# Altium schematic sheet Fri3D_IRA_Power.SchDoc: Power
size A3; Date: 25/07/2021; DrawnBy: Wim Van Gool; DocumentNumber: 4; Revision: 00; SheetNumber: 4; SheetTotal: 4
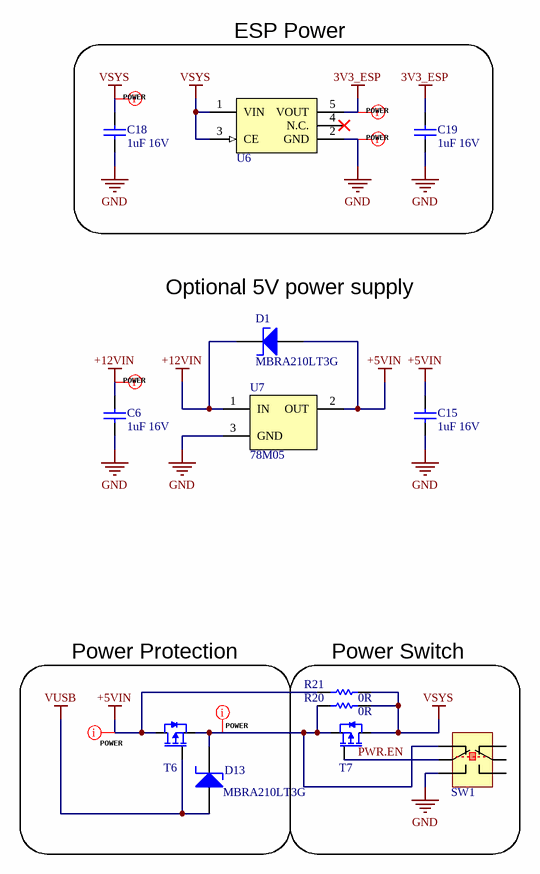
[diagram p0: Fri3D_IRA_Power.SchDoc]

## Parts
C6  value 1uF 16V  [C0603_N]  (hidden comment: CAP_CERAMIC)
C15  value 1uF 16V  [C0603_N]  (hidden comment: CAP_CERAMIC)
C18  value 1uF 16V  [C0603_N]  (hidden comment: CAP_CERAMIC)
C19  value 1uF 16V  [C0603_N]  (hidden comment: CAP_CERAMIC)
D1  MBRA210LT3G  [SMA_AC]
D13  MBRA210LT3G  [SMA_AC]
R20  value 0R  [R0603_N]  (hidden comment: RESISTOR)
R21  value 0R  [R0603_N]  (hidden comment: RESISTOR)
SW1  Mini slide switch 2P2T  [MSS22D18]  (value not drawn)
T6  -2.3A -20V P-Ch MOSFET Vgs -1V  [SOT23-3]  (value not drawn)
T7  -2.3A -20V P-Ch MOSFET Vgs -1V  [SOT23-3]  (value not drawn)
U6  3V3 LDO 700mA 50mV  [SOT23-5]  (value not drawn)
U7  78M05  [TO-252]

## Blocks framed on the sheet
ESP Power: C18 C19 U6
Power Protection: D13 T6
Power Switch: R20 R21 SW1 T7

## Nets
3V3_ESP: C19.1 U6.5(VOUT)
+5VIN: C15.1 D1.A R21.2 T6.3(D) U7.2(OUT)
+12VIN: C6.1 D1.C U7.1(IN)
GND: C6.2 C15.2 C18.2 C19.2 SW1.5 U6.2(GND) U7.3(GND)
VSYS: C18.1 R20.1 R21.1 T7.3(D) U6.1(VIN) U6.3(CE)
VUSB: D13.A T6.1(G)
PWR.EN: SW1.3 T7.1(G)
NetD13_C: D13.C R20.2 SW1.1 T6.2(S) T7.2(S)

Not connected (* = marked no-connect by the designer): SW1 2 4 6(5); U6 4(N.C.)*

## Layout directives
net class POWER: 3V3_ESP, +5VIN, +12VIN, GND, NetD13_C, VSYS

## Notes on the sheet
- (near D1) Optional 5V power supply
- Title
- Revision
- Date
- Dranw By
- Size
- A3
- Sheet
- of

## Library data of the parts
C6 C15 C18 C19 = CAP # 1uF 16V 0603: Capacitor Ceramic; Supplier 1: Farnell; Supplier Part Number 1: 2320814
D1 D13 = Schottky # MBRA210LT3G: =Description
R20 R21 = RES # 0R 0603: Supplier 1: Farnell; Supplier Part Number 1: 2447743; Supplier 3: Generic; Supplier Part Number 3: 0R 1% 0603
SW1 = SW # 2P2T mini slide MSS22D18: Value: MSS22D18; Supplier 1: LCSC; Supplier Part Number 1: C381098; Supplier 2: LCSC; Supplier Part Number 2: C145845; Supplier 3: AliExpress; Supplier Part Number 3: MSS22D18
T6 T7 = SL2301 P-Ch MOSFET -2.3A -20Vds: =Description; Value: SL2301; Supplier 1: LCSC; Supplier Part Number 1: C181086
U6 = LDO # 3V3 XC6210B33: =Designator; Value: XC6210B332MR; Supplier 1: Farnell; Supplier Part Number 1: 1057803
U7 = PWR # 78M05 5V LDO TO252: 78M05 5V 750mA LDO; Value: 78M05